# Altium schematic sheet Sheet1.SchDoc
size A; SheetNumber: 1; SheetTotal: 1
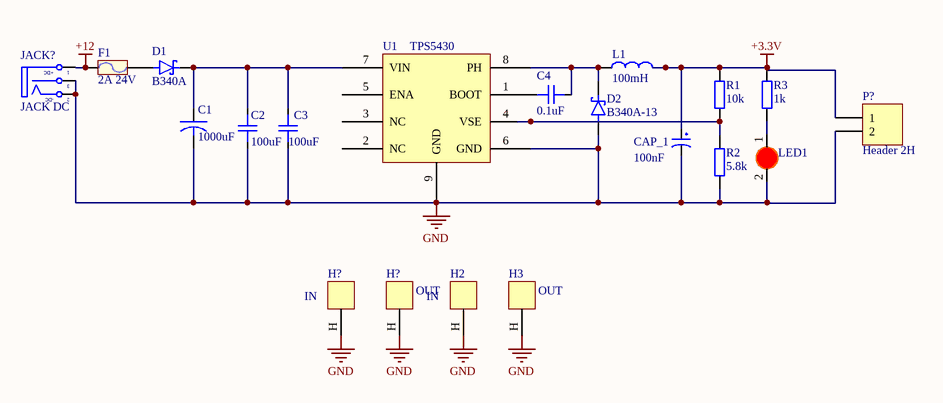
[diagram p0: Sheet1.SchDoc]

## Parts
(Parts that share a designator on the sheet are numbered #1, #2 ... from top to bottom, then left to right.)
C1  1000uF  [CAP SMD ELEC]
C2  100uF  [CAP_0805]
C3  100uF  [CAP_0805]
C4  0.1uF  [CAP_0805]
CAP_1  100nF  [tu tantalum smd7343]
D1  B340A  [B340A]
D2  B340A-13  [B340A]
F1  2A 24V  [Cau chi tu phuc hoi 2A 24V SMD1812 - duplicate]
H2  IN  [HOLE]
H3  OUT  [HOLE]
H?#1  IN  [HOLE]
H?#2  OUT  [HOLE]
JACK?  JACK DC  [JACK DC]
L1  100mH  [CUON CAM SMD 0530]
LED1  LED_0805_RED  [LED-0805-Red]  (value not drawn)
P?  Header 2H  [HDR1X2]
R1  10k  [RES_0805]
R2  5.8k  [RES_0805]
R3  1k  [RES_0805]
U1  TPS5430  [TPS5430DDAR]

## Nets
+3.3V: CAP_1.1 L1.2 P?.1 R1.2 R3.2
+12: F1.1 JACK?.1(T)
GND: C1.2 C2.1 C3.1 CAP_1.2 D2.A H2.H(HOLE) H3.H(HOLE) H?#1.H(HOLE) H?#2.H(HOLE) JACK?.2(TN) JACK?.3(S) LED1.2(K) P?.2 R2.1 U1.6(GND) U1.9(GND)
NetC1_1: C1.1 C2.2 C3.2 D1.C U1.7(VIN)
NetC4_1: C4.1 U1.1(BOOT)
NetC4_2: C4.2 D2.C L1.1 U1.8(PH)
NetD1_A: D1.A F1.2
NetLED1_1: LED1.1(A) R3.1
NetR1_1: R1.1 R2.2 U1.4(VSE)

Not connected (* = marked no-connect by the designer): U1 2(NC) 3(NC) 5(ENA)

## Notes on the sheet
- (in symbol JACK DC) +DC; -DC

## Library data of the parts
C1 = CAPACITOR
C2-C4 = CAP_0805: Capacitor SMD 0805; Manufacturer: *; Manufacturer Part Number: *; Distributor Link: *; LCSC: *; Rating: *; Dielectric: *
CAP_1 = cap_tantan
D1 D2 = B340A-13: Diode Schottky 40 V 3A Surface Mount SMA; MF: Diodes Inc.; Value: *; MP: B340A-13; Package: DO-214 Diodes Inc.; Availability: In Stock; Price: None; SnapEDA_Link: https://www.snapeda.com/parts/B340A-13/Diodes+Inc./view-part/?ref=snap; Check_prices: https://www.snapeda.com/parts/B340A-13/Diodes+Inc./view-part/?ref=eda; Purchase-URL: https://pricing.snapeda.com/search/part/B340A-13/?ref=eda
F1 = Fuse self-recovering: 2A 24V SMD1812; Ma_Hang: MH010033; Ten: Cầu Chì Tự Phục Hồi 2A 24V SMD1812
H2 H3 H?#1 H?#2 = HOLE
JACK? = JACK DC: Value: Jac DC
L1 = INDUCTOR
R1-R3 = RES_0805: Resistor SMD 0805; Manufacturer: *; Manufacturer Part Number: *; Distributor Link: *; LCSC: *
P? = Header 2H: LatestRevisionDate: 17-Jul-2002; LatestRevisionNote: Re-released for DXP Platform.; Publisher: Altium Limited